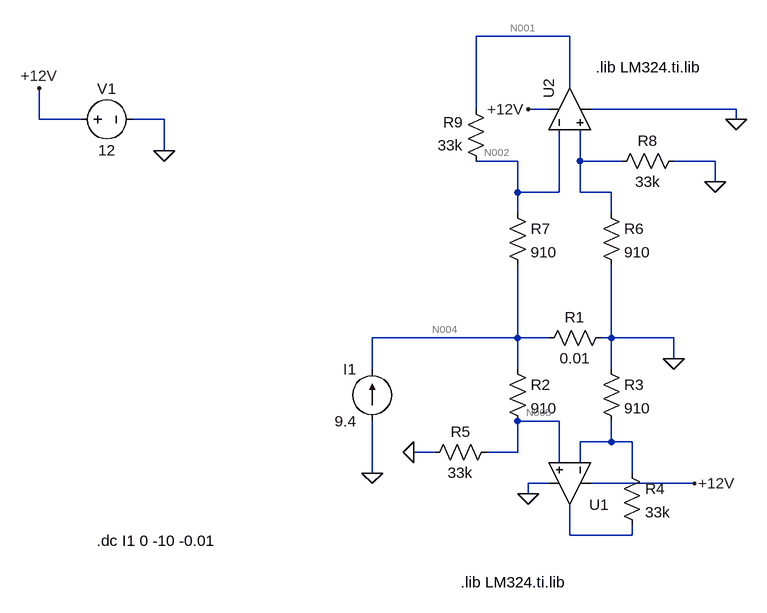
[diagram p0: schematic shunt current.asc]
shunt current.asc, the LTspice schematic file:
Version 4
SHEET 1 1204 680
WIRE 96 -448 -48 -448
WIRE 96 -368 96 -448
WIRE -48 -336 -48 -448
WIRE 64 -336 32 -336
WIRE 352 -336 128 -336
WIRE -720 -320 -720 -368
WIRE -656 -320 -720 -320
WIRE -528 -320 -576 -320
WIRE 352 -320 352 -336
WIRE -528 -272 -528 -320
WIRE 16 -256 -48 -256
WIRE 112 -256 112 -304
WIRE 176 -256 112 -256
WIRE 320 -256 256 -256
WIRE 320 -224 320 -256
WIRE 16 -208 16 -256
WIRE 80 -208 80 -304
WIRE 80 -208 16 -208
WIRE 112 -208 112 -256
WIRE 160 -208 112 -208
WIRE 16 -176 16 -208
WIRE 160 -176 160 -208
WIRE 16 16 16 -96
WIRE 16 16 -208 16
WIRE 64 16 16 16
WIRE 160 16 160 -96
WIRE 160 16 144 16
WIRE 256 16 160 16
WIRE 256 48 256 16
WIRE -208 64 -208 16
WIRE 16 64 16 16
WIRE 160 64 160 16
WIRE 80 144 16 144
WIRE 160 176 160 144
WIRE 160 176 112 176
WIRE 192 176 160 176
WIRE -112 192 -144 192
WIRE 16 192 16 144
WIRE 16 192 -32 192
WIRE 80 208 80 144
WIRE 112 208 112 176
WIRE -208 224 -208 144
WIRE 192 224 192 176
WIRE 64 240 32 240
WIRE 288 240 128 240
WIRE 32 256 32 240
WIRE 96 320 96 272
WIRE 192 320 192 304
WIRE 192 320 96 320
FLAG -208 224 0
FLAG -528 -272 0
FLAG -144 192 0
FLAG 32 256 0
FLAG 352 -320 0
FLAG 320 -224 0
FLAG -720 -368 +12V
FLAG 32 -336 +12V
FLAG 288 240 +12V
FLAG 256 48 0
SYMBOL voltage -672 -320 R270
WINDOW 0 32 56 VTop 2
WINDOW 3 -32 56 VBottom 2
SYMATTR InstName V1
SYMATTR Value 12
SYMBOL current -208 144 R180
WINDOW 0 24 80 Left 2
WINDOW 3 24 0 Left 2
SYMATTR InstName I1
SYMATTR Value 9.4
SYMBOL res 160 0 R90
WINDOW 0 0 56 VBottom 2
WINDOW 3 32 56 VTop 2
SYMATTR InstName R1
SYMATTR Value 0.01
SYMBOL Opamps\\UniversalOpAmp 96 240 R90
WINDOW 0 33 -61 VRight 2
SYMATTR InstName U1
SYMBOL res 0 48 R0
SYMATTR InstName R2
SYMATTR Value 910
SYMBOL res 144 48 R0
SYMATTR InstName R3
SYMATTR Value 910
SYMBOL res -16 176 R90
WINDOW 0 0 56 VBottom 2
WINDOW 3 32 56 VTop 2
SYMATTR InstName R5
SYMATTR Value 33k
SYMBOL res 176 208 R0
SYMATTR InstName R4
SYMATTR Value 33k
SYMBOL res 144 -192 R0
SYMATTR InstName R6
SYMATTR Value 910
SYMBOL res 0 -192 R0
SYMATTR InstName R7
SYMATTR Value 910
SYMBOL res 272 -272 R90
WINDOW 0 0 56 VBottom 2
WINDOW 3 32 56 VTop 2
SYMATTR InstName R8
SYMATTR Value 33k
SYMBOL res -32 -240 R180
WINDOW 0 36 76 Left 2
WINDOW 3 36 40 Left 2
SYMATTR InstName R9
SYMATTR Value 33k
SYMBOL Opamps\\UniversalOpAmp 96 -336 R270
SYMATTR InstName U2
TEXT -72 392 Left 2 !.lib LM324.ti.lib
TEXT 136 -400 Left 2 !.lib LM324.ti.lib
TEXT -632 328 Left 2 !.dc I1 0 -10 -0.01

The netlist it stands for:
* shunt current.asc
V1 +12V 0 12
I1 0 N004 9.4
R1 0 N004 0.01
XU1 N005 N006 +12V 0 N007 level1 Avol=1Meg GBW=10Meg Vos=0 En=0 Enk=0 In=0 Ink=0 Rin=500Meg  ; pins In+ In- V+ V- OUT
R2 N004 N005 910
R3 0 N006 910
R5 N005 0 33k
R4 N006 N007 33k
R6 N003 0 910
R7 N002 N004 910
R8 0 N003 33k
R9 N002 N001 33k
XU2 N003 N002 +12V 0 N001 level1 Avol=1Meg GBW=10Meg Vos=0 En=0 Enk=0 In=0 Ink=0 Rin=500Meg  ; pins In+ In- V+ V- OUT
.lib LM324.ti.lib
.lib LM324.ti.lib
.dc I1 0 -10 -0.01
.lib UniversalOpAmp1.lib
.backanno
.end

* Results of the author's LTspice run, read from the files saved beside the schematic
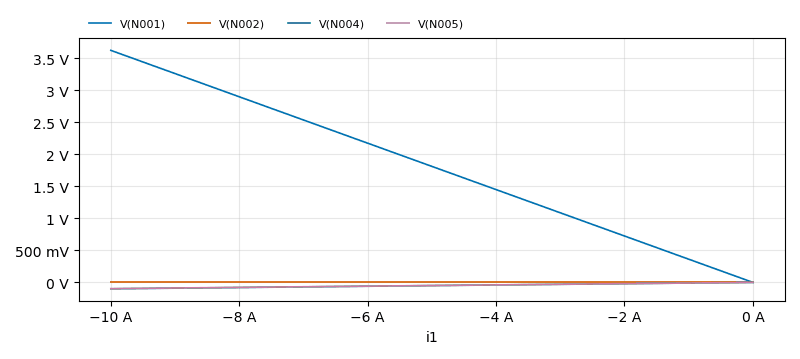
[diagram p1: DC transfer characteristic of shunt current.asc, plotted from the saved traces]
* DC transfer characteristic, 1 run:
*   V(N001): -8.469 nV at i1=0 A, 3.626 V at i1=-10 A, min -8.469 nV, max 3.626 V
*   V(N002): 10.63 µV at i1=0 A, 7.001 µV at i1=-10 A, min 7.001 µV, max 10.63 µV
*   V(N004): 233.6 pV at i1=0 A, -100 mV at i1=-10 A, min -100 mV, max 233.6 pV
*   V(N005): 10.63 µV at i1=0 A, -97.3 mV at i1=-10 A, min -97.3 mV, max 10.63 µV